# EAGLE design usb_ppm-v0.1 (EAGLE 8.5.1)
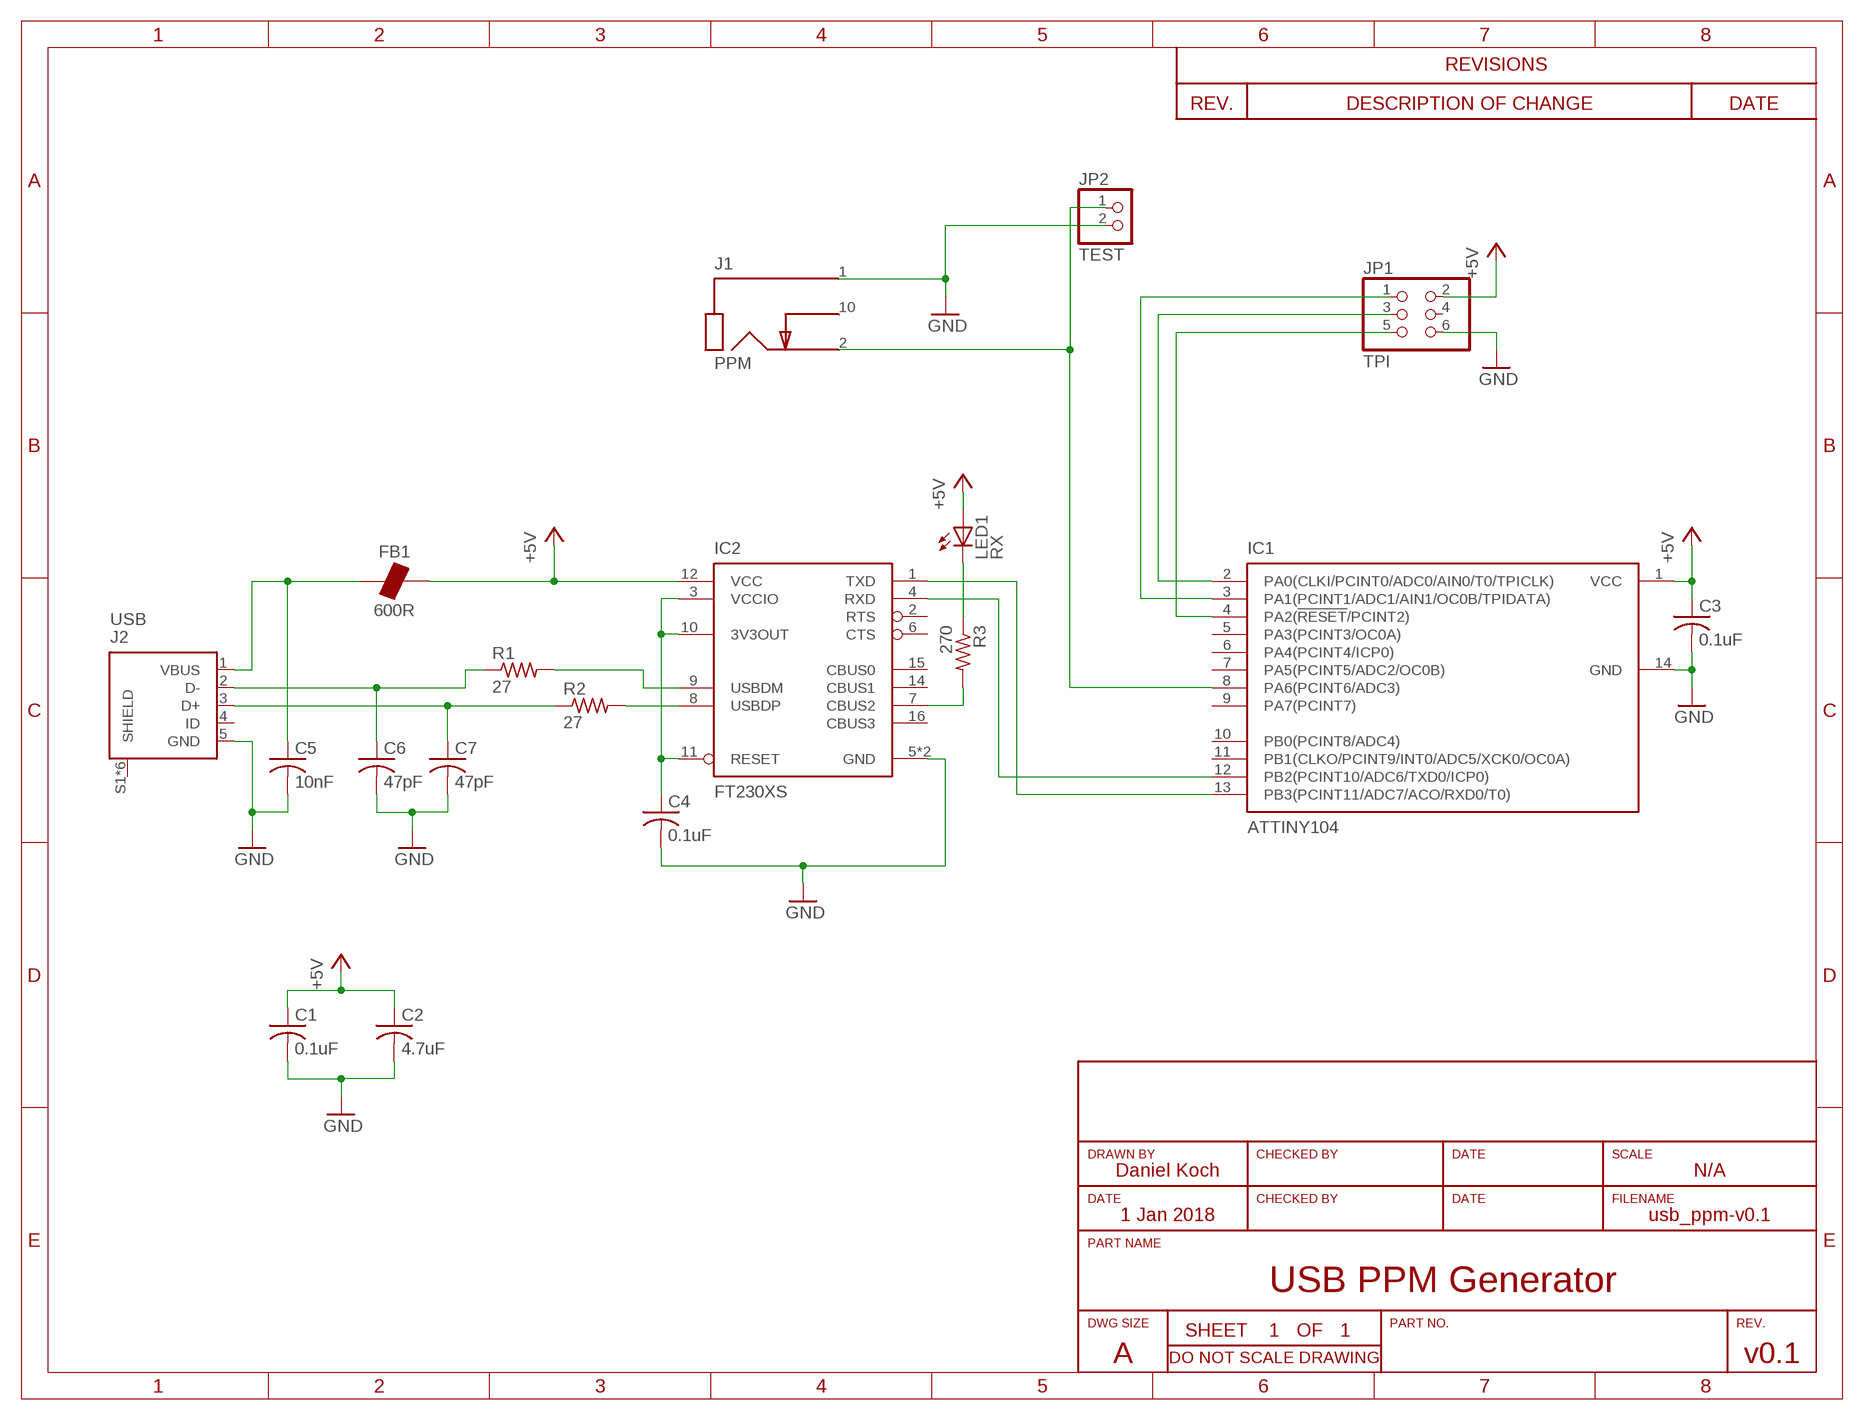
[diagram p0: schematic, sheet 1]
U$1 (FRAME_LETTER): DB_DATE: 1 Jan 2018; DB_NAME: Daniel Koch; DRAWINGSIZE: A; PARTNAME: USB PPM Generator; REV: v0.1; SCALE: N/A

## Parts
C1  0.1uF  C-USC0603  [C0603]
C2  4.7uF  C-USC0603  [C0603]
C3  0.1uF  C-USC0603  [C0603]
C4  0.1uF  C-USC0603  [C0603]
C5  10nF  C-USC0603  [C0603]
C6  47pF  C-USC0603  [C0603]
C7  47pF  C-USC0603  [C0603]
FB1  600R  FB0603  [0603]
IC1  ATTINY104  [SOIC-14]
IC2  FT230XS  [SSOP-16]
J1  PPM  MJ-3523-SMT  [MJ-3523-SMT]
J2  USB  USB-MICRO-B-SMD  [USB-MICRO-B-SMD]
JP1  TPI  PINHD-2X3  [2X03]
JP2  TEST  PINHD-1X2  [1X02]
LED1  RX  LEDCHIP-LED0603  [CHIP-LED0603]
R1  27  R-US_R0603  [R0603]
R2  27  R-US_R0603  [R0603]
R3  270  R-US_R0603  [R0603]

## Nets
3V3OUT: C4.1 IC2.3(VCCIO) IC2.10(3V3OUT) IC2.11(RESET)
+5V: C1.1 C2.1 C3.1 FB1.2 IC1.1(VCC) IC2.12(VCC) JP1.2 LED1.A
GND: C1.2 C2.2 C3.2 C4.2 C5.2 C6.2 C7.2 IC1.14(GND) IC2.5(GND) IC2.13(GND) J1.1(SLEEVE) J2.5(GND) JP1.6 JP2.2
N$1: IC1.13(PB3(PCINT11/ADC7/ACO/RXD0/T0)) IC2.1(TXD)
N$2: IC1.12(PB2(PCINT10/ADC6/TXD0/ICP0)) IC2.4(RXD)
N$3: IC1.8(PA6(PCINT6/ADC3)) J1.2(TIP) JP2.1
N$4: C5.1 FB1.1 J2.1(VBUS)
N$5: LED1.C R3.1
N$6: C6.1 J2.2(D-) R1.1
N$7: C7.1 J2.3(D+) R2.1
N$8: IC2.9(USBDM) R1.2
N$9: IC2.8(USBDP) R2.2
N$10: IC2.7(CBUS2) R3.2
N$11: IC1.3(PA1(PCINT1/ADC1/AIN1/OC0B/TPIDATA)) JP1.1
N$12: IC1.2(PA0(CLKI/PCINT0/ADC0/AIN0/T0/TPICLK)) JP1.3
N$13: IC1.4(PA2(!RESET!/PCINT2)) JP1.5
Unconnected: IC1.5(PA3(PCINT3/OC0A)) IC1.6(PA4(PCINT4/ICP0)) IC1.7(PA5(PCINT5/ADC2/OC0B)) IC1.9(PA7(PCINT7)) IC1.10(PB0(PCINT8/ADC4)) IC1.11(PB1(CLKO/PCINT9/INT0/ADC5/XCK0/OC0A)) IC2.2(RTS) IC2.6(CTS) IC2.14(CBUS1) IC2.15(CBUS0) IC2.16(CBUS3) J1.10(SWITCH) J2.4(ID) J2.S1(SHIELD) J2.S2(SHIELD) J2.S3(SHIELD) J2.S4(SHIELD) J2.S5(SHIELD) J2.S6(SHIELD) JP1.4

## Library data of the parts
C1-C7 = rcl:C-US: CAPACITOR, American symbol; SPICEPREFIX: C
FB1 = discrete:FB: Ferrite Bead Ferrite bead for power/signal filtering
IC1 = IC:ATTINY104: ATtiny104 8-bit AVR Microcontroller
IC2 = IC:FT230X: FT230X FTDI FT230X USB to Basic UART
J1 = connector:MJ-3523-SMT: MJ-3523-SMT 3.5mm surface mount audio jack, mono
J2 = connector:USB-MICRO: Micro USB-B SMD Surface mount micro USB-B port; DIGIKEY-PN: WM11228CT-ND; MFG: Molex; MFG-PN: 0473461001
JP1 = pinhead:PINHD-2X3: PIN HEADER
JP2 = pinhead:PINHD-1X2: PIN HEADER
LED1 = led:LED: LED OSRAM: - CHIPLED LG R971, LG N971, LY N971, LG Q971, LY Q971, LO R971, LY R971 LH N974, LH R974 LS Q976, LO Q976, LY Q976 LO Q996 - Hyper CHIPLED LW Q18S LB Q993, LB Q99A, LB R99A - SideLED LS A670, LO A670, LY A670, LG A670, LP A670 LB A673, LV A673, LT A673, LW A673 LH A674 LY A675 LS A676, LA A676, LO A676, LY A676, LW A676 LS A679, LY A679, LG A679 - Hyper Micro SIDELED® LS Y876, LA Y876, LO Y876, LY Y876 LT Y87S - SmartLED LW L88C, LW L88S LB L89C, LB L89S, LG L890 LS L89K, LO L89K, LY L89K LS L896, LA L896, LO L896, LY L896 - TOPLED LS T670, LO T670, LY T670, LG T670, LP T670 LSG T670, LSP T670, LSY T670, LOP T670, LYG T670 LG T671, LOG T671, LSG T671 LB T673, LV T673, LT T673, LW T673 LH T674 LS T676, LA T676, LO T676, LY T676, LB T676, LH T676, LSB T676, LW T676 LB T67C, LV T67C, LT T67C, LS T67K, LO T67K, LY T67K, LW E67C LS E67B, LA E67B, LO E67B, LY E67B, LB E67C, LV E67C, LT E67C LW T67C LS T679, LY T679, LG T679 LS T770, LO T770, LY T770, LG T770, LP T770 LB T773, LV T773, LT T773, LW T773 LH T774 LS E675, LA E675, LY E675, LS T675 LS T776, LA T776, LO T776, LY T776, LB T776 LHGB T686 LT T68C, LB T68C - Hyper Mini TOPLED® LB M676 - Mini TOPLED Santana® LG M470 LS M47K, LO M47K, LY M47K Source: http://www.osram.convergy.de LUXEON: - LUMILED® LXK2-PW12-R00, LXK2-PW12-S00, LXK2-PW14-U00, LXK2-PW14-V00 LXK2-PM12-R00, LXK2-PM12-S00, LXK2-PM14-U00 LXK2-PE12-Q00, LXK2-PE12-R00, LXK2-PE12-S00, LXK2-PE14-T00, LXK2-PE14-U00 LXK2-PB12-K00, LXK2-PB12-L00, LXK2-PB12-M00, LXK2-PB14-N00, LXK2-PB14-P00, LXK2-PB14-Q00 LXK2-PR12-L00, LXK2-PR12-M00, LXK2-PR14-Q00, LXK2-PR14-R00 LXK2-PD12-Q00, LXK2-PD12-R00, LXK2-PD12-S00 LXK2-PH12-R00, LXK2-PH12-S00 LXK2-PL12-P00, LXK2-PL12-Q00, LXK2-PL12-R00 Source: www.luxeon.com KINGBRIGHT: KA-3528ASYC Source: www.kingbright.com
R1-R3 = rcl:R-US_: RESISTOR, American symbol; SPICEPREFIX: R

## Board
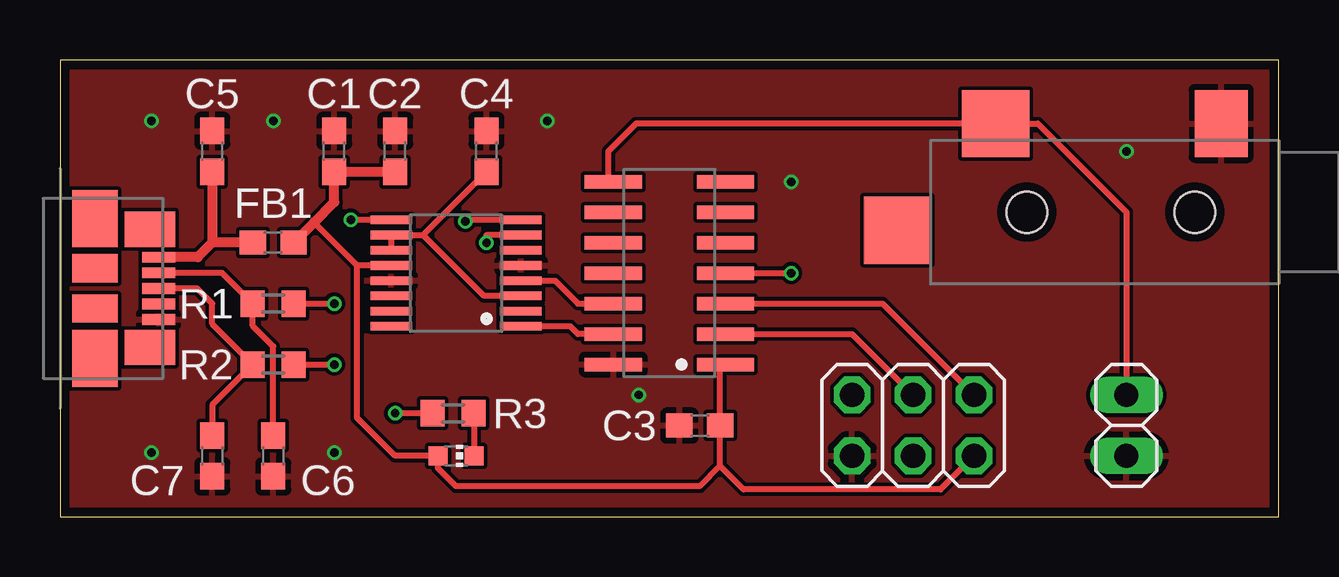
[diagram p1: board, top side]
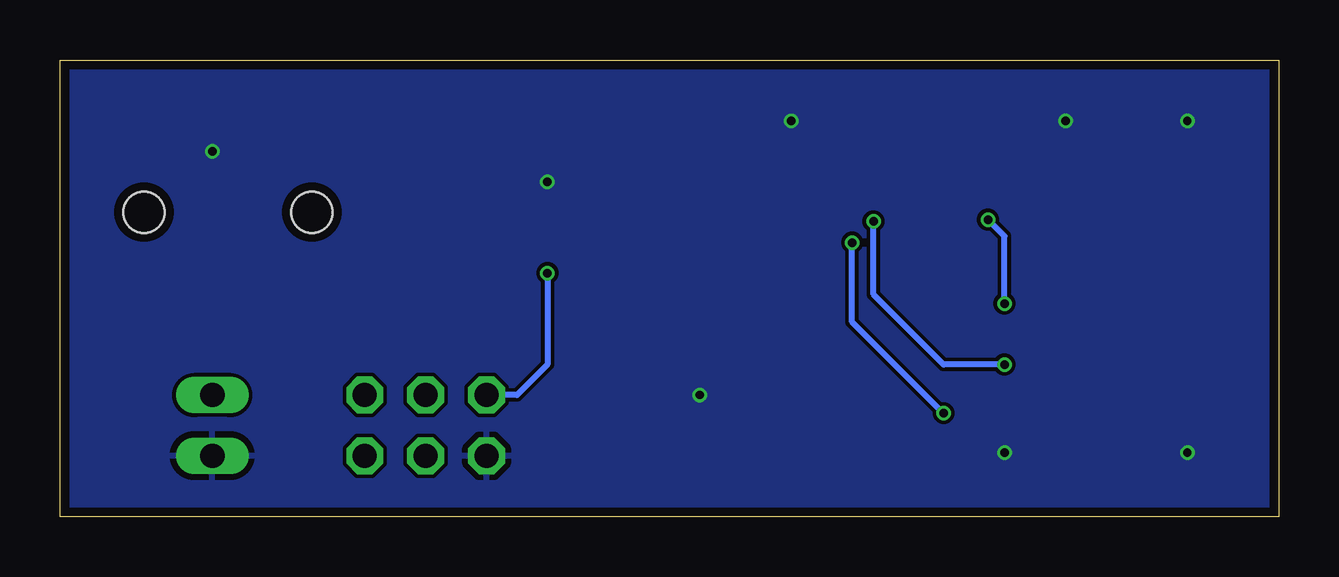
[diagram p2: board, bottom side, seen from below]

Size 50.8 x 19.05 mm. Coordinates in mm from the lower left corner, seen from the top.
Outline: 0,0 50.8,0 50.8,19.05 0,19.05 0,0
Copper layers (1*16): Top 0.035559375mm / dielectric 1.6mm / Bottom 0.035559375mm
Design rules "oshpark-2layer": minimum track width 6mil, minimum drill 10mil, track to track 6mil, track to pad 6mil, pad to pad 6mil, via to via 6mil, smd to smd 6mil, copper to edge 15mil, drill to drill 6mil, minimum pad ring 5mil, minimum via ring 5mil, stop-mask expansion 2.5mil, vias tented up to drill 0mil, thermal gap 10mil

### Footprints (pad centres in the part's own frame; a part is rotated, then mirrored left to right if it is on the bottom)
C0603 = smd 1.1 x 1: 1 -0.85,0; 2 0.85,0
0603 = smd 1.1 x 1: 1 -0.85,0; 2 0.85,0
SOIC-14 = smd 0.559 x 2.388: 1 -3.81,-2.337; 2 -2.54,-2.337; 3 -1.27,-2.337; 4 0,-2.337; 5 1.27,-2.337; 6 2.54,-2.337; 7 3.81,-2.337; 8 3.81,2.337; 9 2.54,2.337; 10 1.27,2.337; 11 0,2.337; 12 -1.27,2.337; 13 -2.54,2.337; 14 -3.81,2.337
SSOP-16 = smd 0.356 x 1.727: 1 -2.223,-2.705; 2 -1.587,-2.705; 3 -0.953,-2.705; 4 -0.318,-2.705; 5 0.318,-2.705; 6 0.953,-2.705; 7 1.587,-2.705; 8 2.223,-2.705; 9 2.223,2.705; 10 1.587,2.705; 11 0.953,2.705; 12 0.318,2.705; 13 -0.318,2.705; 14 -0.953,2.705; 15 -1.587,2.705; 16 -2.223,2.705
MJ-3523-SMT = smd 2.2 x 2.8: 1 2.4,-3.7 | smd 2.8 x 2.8: 2 11.8,-3.7; 10 15.9,0.75 | hole 1.7: 3.5,0; 10.5,0
USB-MICRO-B-SMD = smd 1.38 x 0.45: 1 4.11,1.3; 2 4.11,0.65; 3 4.11,0; 4 4.11,-0.65; 5 4.11,-1.3 | smd 1.9 x 2.375: S1 1.45,2.913; S4 1.45,-2.913 | smd 1.9 x 1.175: S2 1.45,0.838; S3 1.45,-0.838 | smd 2.1 x 1.475: S5 3.75,2.462; S6 3.75,-2.462
2X03 = drill 1.016 octagon: 1 -2.54,-1.27; 2 -2.54,1.27; 3 0,-1.27; 4 0,1.27; 5 2.54,-1.27; 6 2.54,1.27
1X02 = drill 1.016 long: 1 -1.27,0; 2 1.27,0
CHIP-LED0603 = smd 0.8 x 0.8: A 0,-0.75; C 0,0.75
R0603 = smd 1 x 1.1: 1 -0.85,0; 2 0.85,0

### Placement (x,y rotation side)
C1  11.43,15.24 90 top
C2  13.97,15.24 90 top
C3  26.67,3.81 180 top
C4  17.78,15.24 90 top
C5  6.35,15.24 90 top
C6  8.89,2.54 270 top
C7  6.35,2.54 270 top
FB1  8.89,11.43 0 top
IC1  25.4,10.16 90 top
IC2  16.51,10.16 90 top
J1  50.8,12.7 180 top
J2  0,9.53 0 top
JP1  35.56,3.81 180 top
JP2  44.45,3.81 270 top
LED1  16.51,2.54 270 top
R1  8.89,8.89 0 top
R2  8.89,6.35 0 top
R3  16.38,4.32 180 top

### Tracks (layer width: path | path; a pad name or v marks a point on that pad's centre or on a via)
3V3OUT
  Top 0.254: 15.14,11.75 IC2.10 IC2.11 | 15.14,11.75 C4.1 | IC2.3 17.68,9.21 15.14,11.75
+5V
  Top 0.254: IC2.12 12.38,10.48 | 12.38,10.48 10.59,12.28 | 12.38,10.48 12.38,4.13 13.97,2.54 LED1.A 15.76,2.02 16.51,1.27 26.67,1.27 27.52,2.12 | 27.52,2.12 C3.1 27.52,6.13 IC1.1 | JP1.2 36.7,1.14 28.5,1.14 27.52,2.12
  Top 0.406: FB1.2 10.59,12.28 11.43,13.12 C1.1 C2.1
GND  (via drill 0.35)
  other vias: 3.81,16.51 8.89,16.51 3.81,2.67 11.43,2.67 20.32,16.51 24.13,5.08 30.48,13.97 44.45,15.24
  pour Top: 0,19.05 50.8,19.05 50.8,0 0,0
  pour Bottom: 0,19.05 50.8,19.05 50.8,0 0,0
N$1
  Top 0.254: IC1.13 21.59,7.62 21.27,7.94 IC2.1
N$2
  Top 0.254: IC1.12 21.59,8.89 20.64,9.84 IC2.4
N$3
  Top 0.254: IC1.8 22.86,14.17 22.86,15.24 24.02,16.4 J1.2 40.75,16.4 44.45,12.7 JP2.1
N$4
  Top 0.406: C5.1 6.35,11.43 | 6.35,11.43 5.75,10.82 J2.1 | FB1.1 6.35,11.43
N$5
  Top 0.254: R3.1 17.26,4.29 LED1.C
N$6
  Top 0.254: J2.2 6.75,10.18 R1.1 8.04,7.96 8.89,7.11 C6.1
N$7
  Top 0.254: C7.1 6.35,4.66 R2.1 6.35,8.04 6.35,8.89 5.71,9.53 J2.3
N$8  (via drill 0.35)
  Top 0.254: R1.2 v11.43,8.89 | IC2.9 v12.13,12.38 v12.12,12.39
  Bottom 0.254: v11.43,8.89 11.43,11.7 v12.12,12.39
N$9  (via drill 0.35)
  Top 0.254: R2.2 v11.43,6.35 | IC2.8 16.95,12.38 v16.89,12.32
  Bottom 0.254: v11.43,6.35 13.97,6.35 16.89,9.27 v16.89,12.32
N$10  (via drill 0.35)
  Top 0.254: IC2.7 17.78,11.75 v17.78,11.43 | R3.2 v13.97,4.32
  Bottom 0.254: v13.97,4.32 17.78,8.13 v17.78,11.43
N$11
  Top 0.254: IC1.3 34.29,8.89 JP1.1
N$12
  Top 0.254: IC1.2 33.02,7.62 JP1.3
N$13  (via drill 0.35)
  Top 0.254: IC1.4 v30.48,10.16
  Bottom 0.254: v30.48,10.16 30.48,6.35 31.75,5.08 JP1.5

### Text on the board
tValues: 5 | 1 | PPM | 6 | 2 | GND